# Altium schematic sheet D02-2-00 Circuit Power.SchDoc
size A3; SheetNumber: 2; SheetTotal: 3
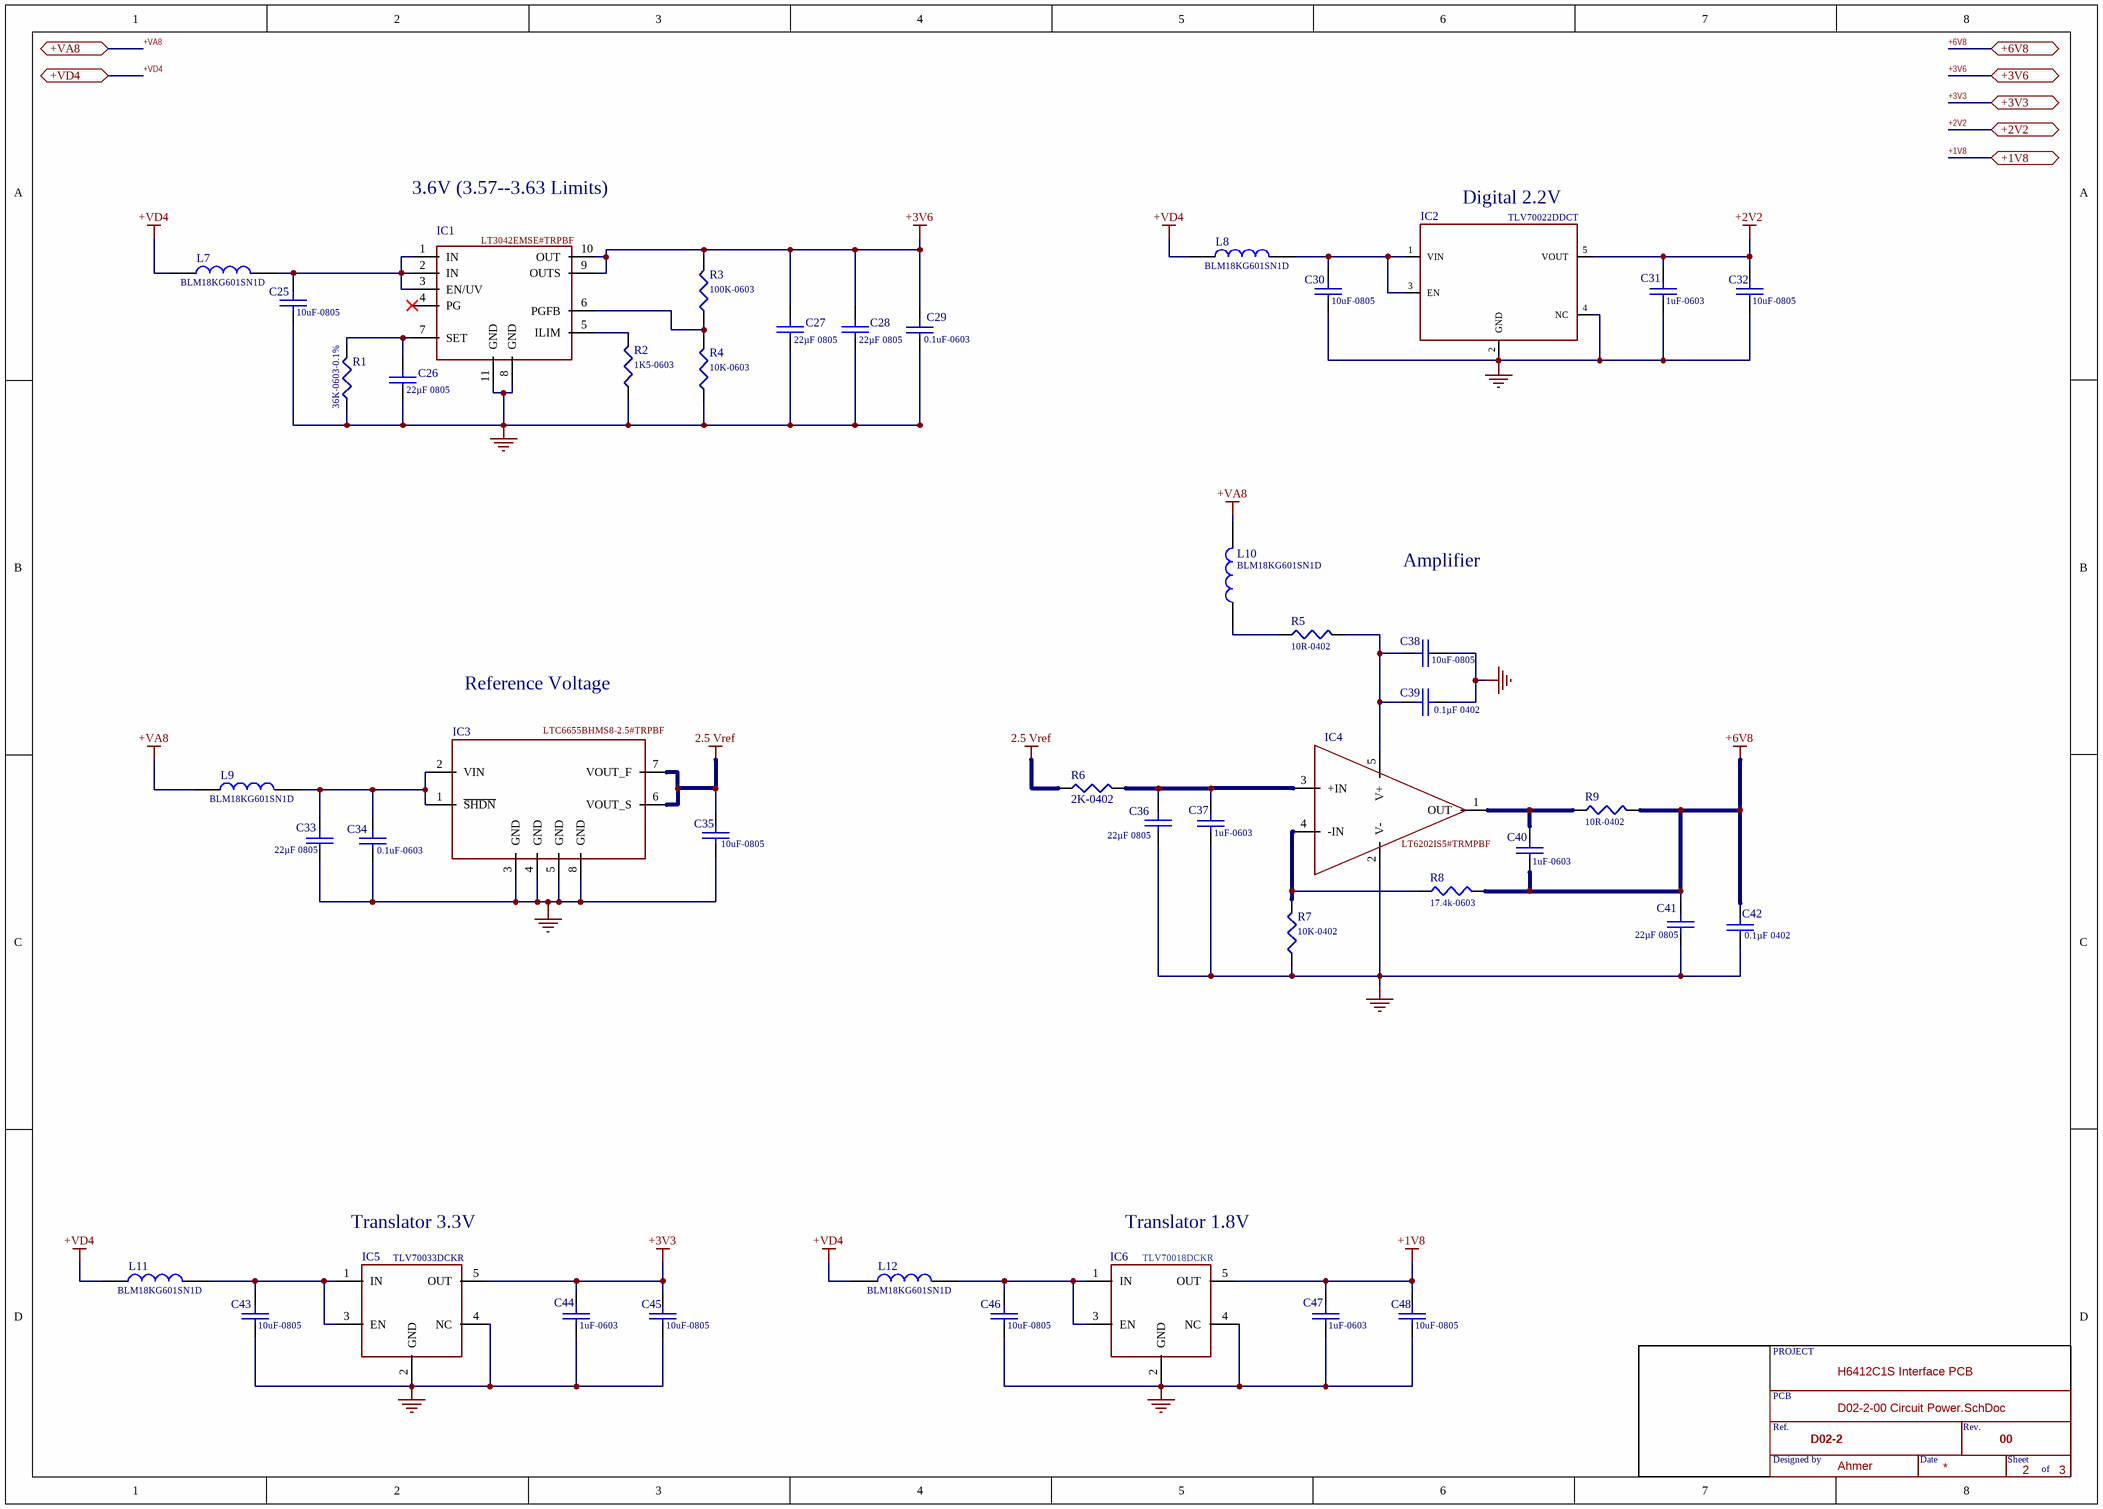
[diagram p0: D02-2-00 Circuit Power.SchDoc]

## Parts
*?  Title Box  (value not drawn)
C25  10uF-0805  [C0805]
C26  22µF 0805  [C-0805]
C27  22µF 0805  [C-0805]
C28  22µF 0805  [C-0805]
C29  0.1uF-0603  [C0603X104J4RECAUTO]
C30  10uF-0805  [C0805]
C31  1uF-0603  [C0603X105J8RACAUTO]
C32  10uF-0805  [C0805]
C33  22µF 0805  [C-0805]
C34  0.1uF-0603  [C0603X104J4RECAUTO]
C35  10uF-0805  [C0805]
C36  22µF 0805  [C-0805]
C37  1uF-0603  [C0603X105J8RACAUTO]
C38  10uF-0805  [C0805]
C39  0.1µF 0402  [C-0402]
C40  1uF-0603  [C0603X105J8RACAUTO]
C41  22µF 0805  [C-0805]
C42  0.1µF 0402  [C-0402]
C43  10uF-0805  [C0805]
C44  1uF-0603  [C0603X105J8RACAUTO]
C45  10uF-0805  [C0805]
C46  10uF-0805  [C0805]
C47  1uF-0603  [C0603X105J8RACAUTO]
C48  10uF-0805  [C0805]
IC1  LT3042EMSE#TRPBF  [MSE10]
IC2  TLV70022DDCT  [SOT-23-THN (DDC)]
IC3  LTC6655BHMS8-2.5#TRPBF  [MSOP8 for LTC6655BHMS8-2.5#TRPBF]
IC4  LT6202IS5#TRMPBF  [TSOT23-5 for LT6202IS5#TRMPBF]
IC5  TLV70033DCKR  [SC70 (DCK)]
IC6  TLV70018DCKR  [SC70 (DCK)]
L7  BLM18KG601SN1D  [BLM18K]
L8  BLM18KG601SN1D  [BLM18K]
L9  BLM18KG601SN1D  [BLM18K]
L10  BLM18KG601SN1D  [BLM18K]
L11  BLM18KG601SN1D  [BLM18K]
L12  BLM18KG601SN1D  [BLM18K]
R1  36K-0603-0.1%  [ERA-3APB363V 0603]
R2  1K5-0603  [R0603]
R3  100K-0603  [R0603]
R4  10K-0603  [R0603]
R5  10R-0402  [R0402]
R6  2K-0402  [R0402]
R7  10K-0402  [R0402]
R8  17.4k-0603  [R-0603]
R9  10R-0402  [R0402]

## Ports
+1V8 (bidir), +2V2 (bidir), +3V3 (bidir), +3V6 (bidir), +6V8 (bidir), +VA8 (bidir), +VD4 (bidir)

## Nets
2.5 Vref: C35.2 IC3.6(VOUT_S) IC3.7(VOUT_F) R6.1
+1V8: C47.2 C48.2 IC6.5(OUT) ; port +1V8
+2V2: C31.2 C32.2 IC2.5(VOUT) ; port +2V2
+3V3: C44.2 C45.2 IC5.5(OUT) ; port +3V3
+3V6: C27.2 C28.2 C29.2 IC1.9(OUTS) IC1.10(OUT) R3.2 ; port +3V6
+6V8: C40.1 C41.2 C42.2 R8.2 R9.2 ; port +6V8
+VA8: L9.1 L10.2 ; port +VA8
+VD4: L7.1 L8.1 L11.1 L12.1 ; port +VD4
GND: C25.1 C26.1 C27.1 C28.1 C29.1 C30.1 C31.1 C32.1 C33.1 C34.1 C35.1 C36.1 C37.1 C38.1 C39.1 C41.1 C42.1 C43.1 C44.1 C45.1 C46.1 C47.1 C48.1 IC1.8(GND) IC1.11(GND) IC2.2(GND) IC2.4(NC) IC3.3(GND) IC3.4(GND) IC3.5(GND) IC3.8(GND) IC4.2(V-) IC5.2(GND) IC5.4(NC) IC6.2(GND) IC6.4(NC) R1.1 R2.1 R4.1 R7.1
NetC25_2: C25.2 IC1.1(IN) IC1.2(IN) IC1.3(EN/UV) L7.2
NetC26_2: C26.2 IC1.7(SET) R1.2
NetC30_2: C30.2 IC2.1(VIN) IC2.3(EN) L8.2
NetC33_2: C33.2 C34.2 IC3.1(~{SHDN}) IC3.2(VIN) L9.2
NetC36_2: C36.2 C37.2 IC4.3(+IN) R6.2
NetC38_2: C38.2 C39.2 IC4.5(V+) R5.2
NetC40_2: C40.2 IC4.1(OUT) R9.1
NetC43_2: C43.2 IC5.1(IN) IC5.3(EN) L11.2
NetC46_2: C46.2 IC6.1(IN) IC6.3(EN) L12.2
NetIC1_5: IC1.5(ILIM) R2.2
NetIC1_6: IC1.6(PGFB) R3.1 R4.2
NetIC4_4: IC4.4(-IN) R7.2 R8.1
NetL10_1: L10.1 R5.1

Not connected (* = marked no-connect by the designer): IC1 4(PG)*

## Notes on the sheet
- 3.6V (3.57--3.63 Limits)
- (near IC2) Digital 2.2V
- Amplifier
- Reference Voltage
- (near IC5) Translator 3.3V
- (near IC6) Translator 1.8V
- (in symbol Title Box) PROJECT; H6412C1S Interface PCB; PCB; Ref.; Rev.; D02-2; 00; Designed by; Date; Sheet; Ahmer; of

## Library data of the parts
C25 C30 C32 C35 C38 C43 C45 C46 C48 = CAP-0805
C26-C28 C33 C36 C41 = GRM219R61A226MEA0D: CC 22µF 0805 10V ±20% X5R; Manufacturer: Murata; Dielectric Material: Ceramic; Dissipation Factor: 0.035%; Capacitance: 22uF; Supplier 1: Digi-Key; Manufacturer Part Number: GRM219R61A226MEA0D; RoHS: Yes; Category: Ceramic Capacitors; Stock 1: 93694; Pricing 1: 1=0.52000, 10=0.36400, 50=0.25480, 100=0.21840, 500=0.16378, 1000=0.13831 (USD); Mount: Surface Mount; Case/Package: 0805; Case Code (Metric): 2012; Case Code (Imperial): 0805; Min Operating Temperature: -55°C; Max Operating Temperature: 85°C; Tolerance: 20%; Dielectric: X5R; Voltage Rating (DC): 10V; Packaging: Cut Tape; Voltage Rating: 10V; Voltage: 10V; Termination: SMD/SMT; Length: 0.079inch; Width: 0.049inch; Height: 0.85mm; Thickness: 0.037inch; Depth: 1.25mm; REACH SVHC: No SVHC; RoHS Compliant: Yes; ComponentLink1URL: http://www.farnell.com/datasheets/2079175.pdf?src-supplier=Farnell; ComponentLink1Description: http://www.farnell.com/datasheets/2079175.pdf?src-supplier=Farnell; ComponentLink2URL: http://search.murata.co.jp/Ceramy/image/img/A01X/G101/ENG/GRM219R61A226MEA0-01.pdf?src-supplier=Avnet+Europe; ComponentLink2Description: http://search.murata.co.jp/Ceramy/image/img/A01X/G101/ENG/GRM219R61A226MEA0-01.pdf?src-supplier=Avnet+Europe; ComponentLink3URL: http://www.farnell.com/datasheets/2079175.pdf?src-supplier=Newark; ComponentLink3Description: http://www.farnell.com/datasheets/2079175.pdf?src-supplier=Newark; ComponentLink4URL: http://search.murata.co.jp/Ceramy/image/img/A01X/G101/ENG/GRM219R61A226MEA0-01.pdf?src-supplier=Mouser; ComponentLink4Description: http://search.murata.co.jp/Ceramy/image/img/A01X/G101/ENG/GRM219R61A226MEA0-01.pdf?src-supplier=Mouser; ComponentLink5URL: http://search.murata.co.jp/Ceramy/image/img/A01X/G101/ENG/GRM219R61A226MEA0-01.pdf?src-supplier=Avnet; ComponentLink5Description: http://search.murata.co.jp/Ceramy/image/img/A01X/G101/ENG/GRM219R61A226MEA0-01.pdf?src-supplier=Avnet; ComponentLink6URL: http://search.murata.co.jp/Ceramy/image/img/A01X/G101/ENG/GRM219R61A226MEA0-01.pdf?src-supplier=Digi-Key; ComponentLink6Description: http://search.murata.co.jp/Ceramy/image/img/A01X/G101/ENG/GRM219R61A226MEA0-01.pdf?src-supplier=Digi-Key; ComponentLink7URL: http://www.farnell.com/datasheets/2079175.pdf?src-supplier=Element14; ComponentLink7Description: http://www.farnell.com/datasheets/2079175.pdf?src-supplier=Element14; ComponentLink8URL: http://search.murata.co.jp/Ceramy/image/img/A01X/G101/ENG/GRM219R61A226MEA0-01.pdf?src-supplier=RSComponents; ComponentLink8Description: http://search.murata.co.jp/Ceramy/image/img/A01X/G101/ENG/GRM219R61A226MEA0-01.pdf?src-supplier=RSComponents; ComponentLink9URL: http://search.murata.co.jp/Ceramy/image/img/A01X/G101/ENG/GRM219R61A226MEA0-01.pdf?src-supplier=Area51; ComponentLink9Description: http://search.murata.co.jp/Ceramy/image/img/A01X/G101/ENG/GRM219R61A226MEA0-01.pdf?src-supplier=Area51; ComponentLink10URL: http://search.murata.co.jp/Ceramy/image/img/A01X/G101/ENG/GRM219R61A226MEA0-01.pdf?src-supplier=Quest; ComponentLink10Description: http://search.murata.co.jp/Ceramy/image/img/A01X/G101/ENG/GRM219R61A226MEA0-01.pdf?src-supplier=Quest; ComponentLink11URL: http://search.murata.co.jp/Ceramy/image/img/A01X/G101/ENG/GRM219R61A226MEA0-01.pdf?src-supplier=TTI; ComponentLink11Description: http://search.murata.co.jp/Ceramy/image/img/A01X/G101/ENG/GRM219R61A226MEA0-01.pdf?src-supplier=TTI; Supplier Part Number 1: 490-9951-1-ND
C29 C34 = C0603X104J4RECAUTO: 0.1uF ±5% 16V X7R 0603 (1608 Metric); Manufacturer: KEMET; Supplier 1: Digi-Key; Manufacturer Part Number: C0603X104J4RECAUTO; Stock 1: 13235; Pricing 1: 1=0.24, 10=0.161, 50=0.0966, 100=0.0816, 500=0.0559, 1000=0.0494 (USD); ComponentLink1URL: https://api.kemet.com/component-edge/download/datasheet/C0603X104J4RECAUTO.pdf?src-supplier=Digi-Key; ComponentLink1Description: https://api.kemet.com/component-edge/download/datasheet/C0603X104J4RECAUTO.pdf?src-supplier=Digi-Key; ComponentLink2URL: http://www.farnell.com/datasheets/2743696.pdf?src-supplier=Farnell; ComponentLink2Description: http://www.farnell.com/datasheets/2743696.pdf?src-supplier=Farnell; ComponentLink3URL: http://www.farnell.com/datasheets/2743696.pdf?src-supplier=Newark; ComponentLink3Description: http://www.farnell.com/datasheets/2743696.pdf?src-supplier=Newark; Supplier Part Number 1: 399-17843-1-ND
C31 C37 C40 C44 C47 = C0603X105J8RACAUTO: 1uF ±5% 10V X7R 0603 (1608 Metric); Manufacturer: KEMET; Categories: Capacitors; Capacitance: 1µF; Supplier 1: Digi-Key; Manufacturer Part Number: C0603X105J8RACAUTO; Stock 1: 34197; Pricing 1: 1=0.5, 10=0.355, 50=0.2682, 100=0.2336, 500=0.173, 1000=0.1471 (USD); Series: FT-CAP; Packaging: Tape & Reel (TR); Part Status: Active; Tolerance: ±5%; Voltage - Rated: 10V; Temperature Coefficient: X7R; Operating Temperature: -55°C ~ 125°C; Features: Soft Termination; Ratings: AEC-Q200; Applications: Automotive, Boardflex Sensitive; Failure Rate: -; Mounting Type: Surface Mount, MLCC; Package / Case: 0603 (1608 Metric); Size / Dimension: 0.063 L x 0.031 W (1.60mm x 0.80mm); Height - Seated (Max): -; Thickness (Max): 0.037 (0.95mm); Lead Spacing: -; Lead Style: -; ComponentLink1URL: https://api.kemet.com/component-edge/download/datasheet/C0603X105J8RACAUTO.pdf?src-supplier=Digi-Key; ComponentLink1Description: https://api.kemet.com/component-edge/download/datasheet/C0603X105J8RACAUTO.pdf?src-supplier=Digi-Key; Supplier Part Number 1: 399-17702-1-ND
C39 C42 = GCM155R71C104KA55D: CC 0.1µF 0402 16V ±10% X7R; Manufacturer: Murata; Capacitance: 100nF; Supplier 1: Digi-Key; Manufacturer Part Number: GCM155R71C104KA55D; RoHS: Yes; Category: Ceramic Capacitors; Stock 1: 7256827; Pricing 1: 1=0.10000, 10=0.03500, 50=0.01920, 100=0.01560, 500=0.01116, 1000=0.00877, 2500=0.00798, 5000=0.00734 (USD); Mount: Surface Mount; Case/Package: 0402; Case Code (Metric): 1005; Case Code (Imperial): 0402; Min Operating Temperature: -55°C; Max Operating Temperature: 125°C; Tolerance: 10%; Dielectric: X7R; Package Quantity: 1; Packaging: Tape and Reel; Voltage Rating: 16V; Voltage Rating (DC): 16V; Termination: SMD/SMT; Voltage: 16V; Series: GCM; Construction: Flat; Length: 1mm; Width: 0.02inch; Height: 0.5mm; Thickness: 0.022inch; Depth: 0.5mm; Ratings: AEC-Q200; Radiation Hardening: No; REACH SVHC: No SVHC; Lead Free: Lead Free; RoHS Compliant: Yes; ComponentLink1URL: https://datasheet.ciiva.com/11786/0900766b80ef92d0-11786380.pdf?src-supplier=RSComponents; ComponentLink1Description: https://datasheet.ciiva.com/11786/0900766b80ef92d0-11786380.pdf?src-supplier=RSComponents; ComponentLink2URL: https://datasheet.ciiva.com/18183/getdatasheetpartid-220774-18183517.pdf?src-supplier=Verical; ComponentLink2Description: https://datasheet.ciiva.com/18183/getdatasheetpartid-220774-18183517.pdf?src-supplier=Verical; ComponentLink3URL: https://datasheet.ciiva.com/2989/product-2989234.pdf?src-supplier=Avnet; ComponentLink3Description: https://datasheet.ciiva.com/2989/product-2989234.pdf?src-supplier=Avnet; ComponentLink4URL: https://datasheet.ciiva.com/164/product-164315.pdf?src-supplier=Digi-Key; ComponentLink4Description: https://datasheet.ciiva.com/164/product-164315.pdf?src-supplier=Digi-Key; ComponentLink5URL: https://datasheet.ciiva.com/164/product-164316.pdf?src-supplier=Digi-Key; ComponentLink5Description: https://datasheet.ciiva.com/164/product-164316.pdf?src-supplier=Digi-Key; ComponentLink6URL: https://datasheet.ciiva.com/11463/product-11463804.pdf?src-supplier=Avnet; ComponentLink6Description: https://datasheet.ciiva.com/11463/product-11463804.pdf?src-supplier=Avnet; Supplier Part Number 1: 490-4759-1-ND
IC1 = LT3042EMSE#TRPBF: IC REG LIN POS ADJ 200MA 10MSOP; Manufacturer: Analog Devices / Linear Technology; Regulator Topology: Positive Adjustable; Voltage - Output: 0 V ~ 15 V; Voltage - Dropout (Typical): 0.35V @ 200mA; Number of Regulators: 1; Voltage - Input: 1.8 V ~ 20 V; Current - Limit (Min): 220mA; Supplier 1: Digi-Key; Manufacturer Part Number: LT3042EMSE#TRPBF; Stock 1: 6742; Pricing 1: 1=5.74, 25=3.1756 (USD); Category: Integrated Circuits (ICs); Family: PMIC - Voltage Regulators - Linear; Series: -; Packaging: Tape & Reel (TR); Current - Output: 200mA; Operating Temperature: -40°C ~ 125°C; Mounting Type: Surface Mount; Package / Case: 10-TFSOP, 10-MSOP (0.118", 3.00mm Width) Exposed Pad; Supplier Device Package: 10-MSOP-EP; ComponentLink1URL: http://www.linear.com/docs/55649?src-supplier=Digi-Key; ComponentLink1Description: http://www.linear.com/docs/55649?src-supplier=Digi-Key; ComponentLink2URL: http://www.linear.com/docs/46159?src-supplier=Digi-Key; ComponentLink2Description: http://www.linear.com/docs/46159?src-supplier=Digi-Key; Supplier Part Number 1: LT3042EMSE#TRPBFCT-ND
IC2 = TLV70022DDCT: IC REG LDO 2.2V 200MA SOT23-5; Manufacturer: Texas Instruments; Dropout Voltage: 175mV; Number of Outputs: 1; Max Power Dissipation: 500mW; Max Input Voltage: 5.5V; Min Input Voltage: 2V; Min Current Limit: 220mA; Polarity: Positive; Quiescent Current: 30uA; Accuracy: 2%; Output Type: Fixed; Supplier 1: Digi-Key; Supplier Part Number 1: 296-30509-1-ND; Manufacturer Part Number: TLV70022DDCT; RoHS: Yes; Category: Voltage Regulators - Linear; Stock: 948; Pricing: 1=0.98000, 10=0.87200, 25=0.82800, 100=0.68020 (USD); Case/Package: TSOT; Number of Pins: 5; Min Operating Temperature: -40°C; Max Operating Temperature: 125°C; Package Quantity: 1; Packaging: Tape and Reel; Output Current: 200mA; Output Voltage: 2.2V; Nominal Output Voltage: 2.2V; Power Rating: 500mW; Max Output Current: 200mA; Number of Regulators: 1; Power Dissipation: 500mW; Min Output Voltage: 2.2V; Output Voltage Accuracy: 2%; Max Output Voltage: 2.2V; Series: -; Length: 3.05mm; Width: 1.75mm; Height: 1mm; Radiation Hardening: No; REACH SVHC: No SVHC; Lead Free: Lead Free; RoHS Compliant: Yes; ComponentLink1URL: https://datasheet.ciiva.com/30477/0900766b8119b061-30477102.pdf?src-supplier=RSComponents; ComponentLink1Description: https://datasheet.ciiva.com/30477/0900766b8119b061-30477102.pdf?src-supplier=RSComponents
IC3 = LTC6655BHMS8-2.5#TRPBF: IC VREF SERIES 2.5V 8MSOP; Manufacturer: Analog Devices / Linear Technology; Product Training Modules: LTC6655 - 0.25ppm Noise, Low Drift Precision Buffered Reference Family; Featured Product: LTC6655 - Precision Buffered Reference; Reference Type: Series, Precision; Tolerance: ±0.025%; Temperature Coefficient: 2ppm/°C; Voltage - Input: 3 V ~ 13.2 V; Number of Channels: 1; Current - Quiescent: 7mA; Current - Output: 5mA; Supplier 1: Digi-Key; Manufacturer Part Number: LTC6655BHMS8-2.5#TRPBF; Stock 1: 3113; Pricing 1: 1=14.08, 25=8.4124, 100=7.728, 250=7.3416 (USD); Standard Package: 2,500; Category: Integrated Circuits (ICs); Family: PMIC - Voltage Reference; Voltage - Output: 2.5V; Operating Temperature: -40°C ~ 125°C; Mounting Type: Surface Mount; Package / Case: 8-TSSOP, 8-MSOP (0.118", 3.00mm Width); Supplier Device Package: 8-MSOP; Packaging: Tape & Reel (TR); ComponentLink1URL: http://www.linear.com/docs/28576?src-supplier=Digi-Key; ComponentLink1Description: http://www.linear.com/docs/28576?src-supplier=Digi-Key; ComponentLink2URL: http://datasheet.iiic.cc/linear_technology/LTC6655BHMS8-2.5_TRPBF.pdf?src-supplier=IIIC; ComponentLink2Description: http://datasheet.iiic.cc/linear_technology/LTC6655BHMS8-2.5_TRPBF.pdf?src-supplier=IIIC; Supplier Part Number 1: LTC6655BHMS8-2.5#TRPBFCT-ND
IC4 = LT6202IS5#TRMPBF: LT6202 - Single 100MHz, Rail-to-Rail Input and Output, Ultralow 1.9nVrtHz Noise, Low Power Op Amps; Manufacturer: Analog Devices / Linear Technology; Amplifier Type: General Purpose; Number of Circuits: 1; Slew Rate: 25 V/µs; Current - Input Bias: 3.8µA; Voltage - Input Offset: 2.6mV; Current - Supply: 2.8mA; Current - Output / Channel: 40mA; Voltage - Supply, Single/Dual (±): 2.5 V ~ 12.6 V, ±1.25 V ~ 6.3 V; For Use With: DC1813A-E-ND / - BOARD SAR ADC LTC2369-18 / DC1813A-A-ND / - BOARD SAR ADC LTC2370-16; Other Names: LT6202IS5#PBF / LT6202IS5#PBF-ND / LT6202IS5#TRMPBF-ND / LT6202IS5#TRMPBFTR; Supplier 1: Digi-Key; Manufacturer Part Number: LT6202IS5#TRMPBF; Stock 1: 18548; Pricing 1: 1=4.93, 25=2.948, 100=2.7072, 250=2.5718 (USD); Standard Package: 500; Category: Integrated Circuits (ICs); Family: Linear - Amplifiers - Instrumentation, OP Amps, Buffer Amps; Series: -; Output Type: Rail-to-Rail; Gain Bandwidth Product: 100MHz; -3db Bandwidth: -; Operating Temperature: -40°C ~ 85°C; Mounting Type: Surface Mount; Package / Case: SOT-23-5 Thin, TSOT-23-5; Supplier Device Package: TSOT-23-5; Packaging: Tape & Reel (TR); Dynamic Catalog: General Purpose; ComponentLink1URL: http://www.farnell.com/datasheets/1599504.pdf?src-supplier=Farnell; ComponentLink1Description: http://www.farnell.com/datasheets/1599504.pdf?src-supplier=Farnell; ComponentLink2URL: http://www.jameco.com/Jameco/Products/ProdDS/1745055.pdf?src-supplier=Jameco; ComponentLink2Description: http://www.jameco.com/Jameco/Products/ProdDS/1745055.pdf?src-supplier=Jameco; ComponentLink3URL: http://datasheet.iiic.cc/linear_technology/LT6202IS5_TRMPBF.pdf?src-supplier=IIIC; ComponentLink3Description: http://datasheet.iiic.cc/linear_technology/LT6202IS5_TRMPBF.pdf?src-supplier=IIIC; Supplier Part Number 1: LT6202IS5#TRMPBFCT-ND
IC5 = TLV70033DCKR: IC LDO 2V to 5.5V, 175mV Dropout, 3.3Vout, 200mAout, SC-70-5; Manufacturer: Texas Instruments; Regulator Output Type: Fixed; Polarity Type: Positive; Number of Outputs: 1; Output Voltage: 3.3V; Output Current: 200mA; Power Dissipation: 320mW; Load Regulation: 1mV; Output Voltage Accuracy: ±2%; Dropout Voltage@Current (Max): 0.25@200mA; Supplier 1: Digi-Key; Stock 1: 16597; Pricing 1: 1=0.41, 10=0.329, 25=0.3012, 100=0.203, 250=0.168, 500=0.154, 1000=0.1155 (USD); Voltage Regulator Type: LDO; Topology: LDO; Input Voltage (Min): 2V; Input Voltage: 5.5V; Package Type: SC-70; Packaging: Tape and Reel; Line Regulation: 1mV; Operating Temp Range: -40C to 125C; Operating Temperature Classification: Automotive; Pin Count: 5; Mounting: Surface Mount; ComponentLink1URL: http://www.farnell.com/datasheets/2018939.pdf?src-supplier=Element14; ComponentLink1Description: http://www.farnell.com/datasheets/2018939.pdf?src-supplier=Element14; ComponentLink2URL: http://www.produktinfo.conrad.com/datenblaetter/1000000-1099999/001014637-da-01-en-IC_REG_LDO_3_3V_0_TLV70033DCKR_SOT_5_TID.pdf?src-supplier=Conrad; ComponentLink2Description: http://www.produktinfo.conrad.com/datenblaetter/1000000-1099999/001014637-da-01-en-IC_REG_LDO_3_3V_0_TLV70033DCKR_SOT_5_TID.pdf?src-supplier=Conrad; Supplier Part Number 1: 296-32413-1-ND
IC6 = TLV70018DCKR: TEXAS INSTRUMENTS - TLV70018DCKR - Fixed LDO Voltage Regulator, 2V to 5.5V, 175mV drop, 1.8V/200mA out, SC-70-5; Polarity Type: Positive; Number of Outputs: 1; Output Voltage: 1.8V; Output Current: 200mA; Power Dissipation: 320mW; Load Regulation: 1mV; Output Voltage Accuracy: ±2%; Dropout Voltage@Current (Typ): 0.175@200mA; Supplier 1: Digi-Key; Manufacturer: Texas Instruments; Stock 1: 51165; Pricing 1: 1=0.39, 10=0.338, 25=0.3152, 100=0.234, 250=0.198, 500=0.189, 1000=0.1395 (USD); Voltage Regulator Type: LDO; Topology: LDO; Regulator Output Type: Fixed; Input Voltage (Min): 2V; Input Voltage: 5.5V; Package Type: SC-70; Packaging: Tape and Reel; Line Regulation: 1mV; Operating Temp Range: -40C to 125C; Operating Temperature Classification: Automotive; Pin Count: 5; Mounting: Surface Mount; ComponentLink1URL: http://www.produktinfo.conrad.com/datenblaetter/1000000-1099999/001014631-da-01-en-IC_REG_LDO_1_8V_0_TLV70018DCKR_SOT_5_TID.pdf?src-supplier=Conrad; ComponentLink1Description: http://www.produktinfo.conrad.com/datenblaetter/1000000-1099999/001014631-da-01-en-IC_REG_LDO_1_8V_0_TLV70018DCKR_SOT_5_TID.pdf?src-supplier=Conrad; Supplier Part Number 1: 296-32409-1-ND; Manufacturer Part Number: TLV70018DCKR
L7-L12 = BLM18KG601SN1D: Ind Chip Bead 600 Ohm 25% 100MHz Ferrite 1.3A 0603 Paper T/R; Manufacturer: Murata; Catalog Drawings: BLM18 Series Top BLM18(A,B,E,H,P,R) Series Side; Featured Product: High Current Power Chip Ferrite Bead; Filter Type: Power Line; Number of Lines: 1; Impedance @ Frequency: 600 Ohm @ 100MHz; DC Resistance (DCR) (Max): 150 mOhm; Online Catalog: EMIFIL® BLM18K Series; Kits: 490-5243-ND  - KIT FERRITE CHIP BLM 0603; Other Names: 490-5258-1; Supplier 1: Digi-Key; Stock 1: 450248; Pricing 1: 1=0.1, 10=0.079, 25=0.0712, 50=0.0522, 100=0.0451, 250=0.0356, 500=0.0301, 1000=0.0253 (USD); Standard Package: 1; Category: Filters; Family: Ferrite Beads and Chips; Series: BLM18K; Packaging: Cut Tape (CT); Current Rating (Max): 1.3A; Ratings: -; Operating Temperature: -55°C ~ 125°C; Package / Case: 0603 (1608 Metric); Mounting Type: Surface Mount; Height (Max): 0.037" (0.95mm); Size / Dimension: 0.063" L x 0.031" W (1.60mm x 0.80mm); ComponentLink1URL: https://www.verical.com/server-webapp/html/getDatasheet?partID=226848&src-supplier=Verical; ComponentLink1Description: https://www.verical.com/server-webapp/html/getDatasheet?partID=226848&src-supplier=Verical; ComponentLink2URL: http://www.murata.com/products/catalog/pdf/c31e.pdf?src-supplier=Element14; ComponentLink2Description: http://www.murata.com/products/catalog/pdf/c31e.pdf?src-supplier=Element14; ComponentLink3URL: https://media.digikey.com/pdf/Data%20Sheets/Murata%20PDFs/BLM18yyyyyyN1x.pdf?src-supplier=Digi-Key; ComponentLink3Description: https://media.digikey.com/pdf/Data%20Sheets/Murata%20PDFs/BLM18yyyyyyN1x.pdf?src-supplier=Digi-Key; ComponentLink4URL: http://uk.rs-online.com/webdocs/13ed/0900766b813ed050.pdf?src-supplier=RSComponents; ComponentLink4Description: http://uk.rs-online.com/webdocs/13ed/0900766b813ed050.pdf?src-supplier=RSComponents; Supplier Part Number 1: 490-5258-1-ND; Manufacturer Part Number: BLM18KG601SN1D
R1 = ERA-3APB363V: 36 kOhms ±0.1%  1/10W 0603 (1608 Metric); Manufacturer: Panasonic; Resistor Element Type: Metal Film; Product Range: PANASONIC - ERA Series; Resistance: 36kohm; Power Rating: 100mW; Resistor Case Style: 0603 [1608 Metric]; Temperature Coefficient: ± 15ppm/°C; Voltage Rating: 75V; SVHC: Diboron trioxide (19-Dec-2012); No. of Pins: 2; Resistor Mounting: SMD; SVHC (Secondary): Lead monoxide (lead oxide) (19-Dec-2012); Supplier 1: Digi-Key; Manufacturer Part Number: ERA-3APB363V; Stock 1: 9750; Pricing 1: 1=0.64, 10=0.455, 100=0.2368, 1000=0.1275, 2500=0.1239 (USD); Resistance Tolerance: ± 0.1%; Resistor Element Material: Metal Film; Packaging: Cut Tape; MSL: (Not Applicable); ComponentLink1URL: http://industrial.panasonic.com/www-data/pdf/AOA0000/AOA0000CE26.pdf?src-supplier=Farnell; ComponentLink1Description: http://industrial.panasonic.com/www-data/pdf/AOA0000/AOA0000CE26.pdf?src-supplier=Farnell; ComponentLink2URL: http://industrial.panasonic.com/www-data/pdf/AOA0000/AOA0000CE26.pdf?src-supplier=Avnet; ComponentLink2Description: http://industrial.panasonic.com/www-data/pdf/AOA0000/AOA0000CE26.pdf?src-supplier=Avnet; ComponentLink3URL: https://www.distrelec.biz/Web/Downloads/_t/ds/ERA_eng_tds.pdf?mime=application%2Fpdf&src-supplier=Distrelec; ComponentLink3Description: https://www.distrelec.biz/Web/Downloads/_t/ds/ERA_eng_tds.pdf?mime=application%2Fpdf&src-supplier=Distrelec; Supplier Part Number 1: P36KAYCT-ND
R2-R4 = RES-0603
R5 R9 = TNPW040210R0DEED: 10 Ohm 0402 0.5% 63mW ±25ppm/C; Manufacturer: Vishay; Resistance: 10 Ohms; Voltage Rating: 50 V; Unit Weight: 0.000023 oz; Supplier 1: Digi-Key; Manufacturer Part Number: TNPW040210R0DEED; Stock 1: 19468; Pricing 1: 1=0.69, 10=0.49, 100=0.2546, 1000=0.1371, 2500=0.1332 (USD); Product Category: Thin Film Resistors - SMD; RoHS: True; Brand: Vishay; Tolerance: 0.5 %; Case Code - in: 0402; Power Rating: 63 mW; Temperature Coefficient: 25 PPM / C; Case Code - mm: 1005; Operating Temperature Range: - 55 C to + 125 C; Series: TNPW e3; Packaging: Reel; Height: 0.35 mm; Length: 1 mm; Package / Case: 0402 (1005 metric); Product: Precision Resistors Thin Film SMD; Termination Style: SMD/SMT; Type: High Stability Thin Film Flat Chip Resistor; Width: 0.5 mm; ComponentLink1URL: http://www.vishay.com/docs/28758/tnpw_e3.pdf?src-supplier=Avnet; ComponentLink1Description: http://www.vishay.com/docs/28758/tnpw_e3.pdf?src-supplier=Avnet; Supplier Part Number 1: 541-3903-1-ND
R6 = RT0402DRD072KL: 2K Ohm 0402 0.5% 63mW ±25ppm/C; Manufacturer: Yageo; Altezza custodia: 0.3 mm; Case Length: 1 mm; Case Width: 0.5 mm; Confezione: Reel; Resistenza: 2 kOhms; Package/involucro: 0402 (1005 metric); Potenza nominale: 62.5 mW (1/16 W); Serie: RT; Range di temperatura di lavoro: - 55 C to + 125 C; Stile di terminazione: SMD/SMT; Prodotto: Thin Film Resistors SMD; Tensione nominale: 50 V; Supplier 1: Digi-Key; Manufacturer Part Number: RT0402DRD072KL; Stock 1: 45007; Pricing 1: 1=0.3, 10=0.254, 100=0.0993, 1000=0.0416, 2500=0.0381, 5000=0.0347 (USD); Case Code - in: 0402; Case Code - mm: 1005; Case Height: 0.3 mm; Coefficiente di temperatura: 25 PPM / C; Dimensioni: 0.5 mm W x 1 mm L x 0.3 mm H; Lunghezza custodia: 1 mm; Larghezza custodia: 0.5 mm; Dimensions: 0.5 mm W x 1 mm L x 0.3 mm H; Operating Temperature Range: - 55 C to + 125 C; Produttore: Yageo; RoHS:: Dettagli; RoHS: Details; Resistance: 2 kOhms; Power Rating: 62.5 mW (1/16 W); Package / Case: 0402 (1005 metric); Packaging: Reel; Product: Thin Film Resistors SMD; Series: RT; Tolleranza: 0.5 %; Termination Style: SMD/SMT; Tolerance: 0.5 %; Temperature Coefficient: 25 PPM / C; Voltage Rating: 50 V; Type: High Precision, High Stability; ComponentLink1URL: http://www.yageo.com/NewPortal/yageodocoutput?fileName=/pdf/R-Chip/PYu-RT_1-to-0.05_RoHS_L_5.pdf&src-supplier=Digi-Key; ComponentLink1Description: http://www.yageo.com/NewPortal/yageodocoutput?fileName=/pdf/R-Chip/PYu-RT_1-to-0.05_RoHS_L_5.pdf&src-supplier=Digi-Key; ComponentLink2URL: http://www.mouser.com/ds/2/447/yageodocoutput-1125656.pdf?src-supplier=Mouser; ComponentLink2Description: http://www.mouser.com/ds/2/447/yageodocoutput-1125656.pdf?src-supplier=Mouser; Supplier Part Number 1: 311-2170-1-ND
R7 = ERA-2AED103X: 10K Ohm 0402 0.5% 63mW ±25ppm/C; Manufacturer: Panasonic; Rated Power: 0.063 W; Resistance: 10 kO; Temp Coefficient: ±25 ppm/°C; Supplier 1: Digi-Key; Manufacturer Part Number: ERA-2AED103X; Stock 1: 216604; Pricing 1: 1=0.21, 10=0.179, 100=0.07, 1000=0.0293, 2500=0.0269, 5000=0.0244 (USD); Size Code: 0402; Tolerance (%): ±0.5 %; ComponentLink1URL: http://industrial.panasonic.com/cdbs/www-data/pdf/RDM0000/AOA0000C307.pdf?src-supplier=Farnell; ComponentLink1Description: http://industrial.panasonic.com/cdbs/www-data/pdf/RDM0000/AOA0000C307.pdf?src-supplier=Farnell; ComponentLink2URL: http://www.farnell.com/datasheets/2059650.pdf?src-supplier=Element14; ComponentLink2Description: http://www.farnell.com/datasheets/2059650.pdf?src-supplier=Element14; Supplier Part Number 1: P10KDECT-ND
R8 = ERA-3AEB1742V: RES 17.4K 0603 1/10W  0.1%; Manufacturer: Panasonic; Resistance: 17.4kR; Temperature Coefficient: 25ppm/°C; Power Rating: 100mW; Voltage Rating: 150V; Voltage Rating (DC): 75V; Supplier 1: RSComponents; Supplier Part Number 1: 7088798; Manufacturer Part Number: ERA-3AEB1742V; RoHS: Yes; Category: Chip SMD Resistors; Stock: 1; Pricing: 5=0.50600, 50=0.47100, 100=0.44100, 250=0.40900, 500=0.37400 (USD); Mount: Surface Mount; Case/Package: 0603; Number of Pins: 2; Contact Plating: Tin; Case Code (Metric): 1608; Case Code (Imperial): 0603; Min Operating Temperature: -55°C; Max Operating Temperature: 155°C; Tolerance: 0.1%; Resistor Type: Thin Film; Packaging: Tape and Reel; Package Quantity: 5000; Number of Terminations: 2; Termination: SMD/SMT; Max Power Dissipation: 100mW; Series: ERA-3A; Resistance Tolerance: 0.1%; Construction: Rectangular; Technology: METAL FILM; Length: 1.6mm; Width: 0.8mm; Height: 0.45mm; Depth: 0.8mm; Radiation Hardening: No; REACH SVHC: No SVHC; Military Standard: Not; Lead Free: Lead Free; RoHS Compliant: Yes; ComponentLink1URL: https://datasheet.ciiva.com/11810/0900766b80eb1d8c-11810462.pdf?src-supplier=RSComponents; ComponentLink1Description: https://datasheet.ciiva.com/11810/0900766b80eb1d8c-11810462.pdf?src-supplier=RSComponents; ComponentLink2URL: https://datasheet.ciiva.com/46388/485442-46388124.pdf?src-supplier=Element14; ComponentLink2Description: https://datasheet.ciiva.com/46388/485442-46388124.pdf?src-supplier=Element14; ComponentLink3URL: https://datasheet.ciiva.com/46376/485442-46376345.pdf?src-supplier=Element14; ComponentLink3Description: https://datasheet.ciiva.com/46376/485442-46376345.pdf?src-supplier=Element14; ComponentLink4URL: https://datasheet.ciiva.com/9192/aoa0000ce26-9192555.pdf?src-supplier=Avnet; ComponentLink4Description: https://datasheet.ciiva.com/9192/aoa0000ce26-9192555.pdf?src-supplier=Avnet; ComponentLink5URL: https://datasheet.ciiva.com/17211/aoa0000ce26-17211323.pdf?src-supplier=Avnet+Europe; ComponentLink5Description: https://datasheet.ciiva.com/17211/aoa0000ce26-17211323.pdf?src-supplier=Avnet+Europe